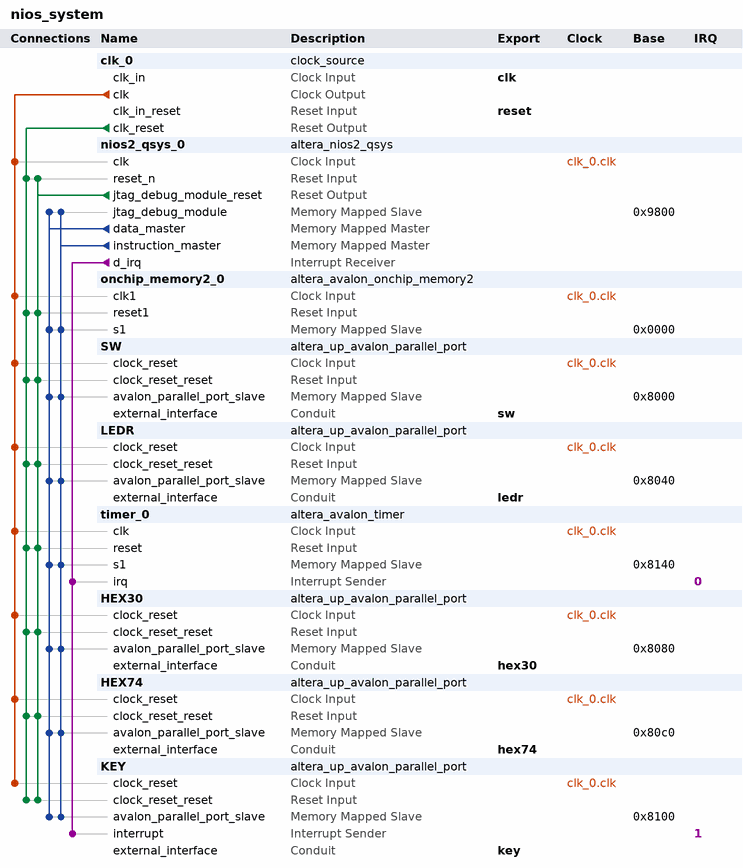
[diagram p0: system contents]
# Platform Designer (Qsys) system nios_system, Cyclone II EP2C35F672C6
# Parameters at their usual value, and those the tool derives, are not listed.
package require -exact qsys 13.0
create_system nios_system
set_project_property DEVICE_FAMILY {Cyclone II}
set_project_property DEVICE EP2C35F672C6

add_instance clk_0 clock_source 13.0
set_instance_parameter_value clk_0 clockFrequency 50000000

add_instance nios2_qsys_0 altera_nios2_qsys 13.0
set_instance_parameter_value nios2_qsys_0 resetSlave onchip_memory2_0.s1
set_instance_parameter_value nios2_qsys_0 mmu_TLBMissExcSlave None
set_instance_parameter_value nios2_qsys_0 exceptionSlave onchip_memory2_0.s1
set_instance_parameter_value nios2_qsys_0 breakSlave nios2_qsys_0.jtag_debug_module
set_instance_parameter_value nios2_qsys_0 impl Small
set_instance_parameter_value nios2_qsys_0 icache_size 4096

add_instance onchip_memory2_0 altera_avalon_onchip_memory2 13.0.1.99.2
set_instance_parameter_value onchip_memory2_0 dataWidth 32
set_instance_parameter_value onchip_memory2_0 dualPort false
set_instance_parameter_value onchip_memory2_0 initMemContent true
set_instance_parameter_value onchip_memory2_0 initializationFileName onchip_mem.hex
set_instance_parameter_value onchip_memory2_0 memorySize 32768

add_instance SW altera_up_avalon_parallel_port 13.0
set_instance_parameter_value SW board DE2
set_instance_parameter_value SW preset {Slider Switches}
set_instance_parameter_value SW capture false
set_instance_parameter_value SW edge Rising
set_instance_parameter_value SW irq false

add_instance LEDR altera_up_avalon_parallel_port 13.0
set_instance_parameter_value LEDR board DE2
set_instance_parameter_value LEDR preset LEDs
set_instance_parameter_value LEDR leds Red
set_instance_parameter_value LEDR capture false
set_instance_parameter_value LEDR edge Rising
set_instance_parameter_value LEDR irq false

add_instance timer_0 altera_avalon_timer 13.0.1.99.2
set_instance_parameter_value timer_0 period 1
set_instance_parameter_value timer_0 periodUnits MSEC

add_instance HEX30 altera_up_avalon_parallel_port 13.0
set_instance_parameter_value HEX30 board DE2
set_instance_parameter_value HEX30 preset {Seven Segment Displays}
set_instance_parameter_value HEX30 capture false
set_instance_parameter_value HEX30 edge Rising
set_instance_parameter_value HEX30 irq false

add_instance HEX74 altera_up_avalon_parallel_port 13.0
set_instance_parameter_value HEX74 board DE2
set_instance_parameter_value HEX74 preset {Seven Segment Displays}
set_instance_parameter_value HEX74 sevensegs {7 to 4}
set_instance_parameter_value HEX74 capture false
set_instance_parameter_value HEX74 edge Rising
set_instance_parameter_value HEX74 irq false

add_instance KEY altera_up_avalon_parallel_port 13.0
set_instance_parameter_value KEY board DE2
set_instance_parameter_value KEY preset Pushbuttons
set_instance_parameter_value KEY capture true
set_instance_parameter_value KEY edge Rising
set_instance_parameter_value KEY irq true

# connections
add_connection clk_0.clk HEX30.clock_reset clock
add_connection clk_0.clk HEX74.clock_reset clock
add_connection clk_0.clk KEY.clock_reset clock
add_connection clk_0.clk LEDR.clock_reset clock
add_connection clk_0.clk nios2_qsys_0.clk clock
add_connection clk_0.clk onchip_memory2_0.clk1 clock
add_connection clk_0.clk SW.clock_reset clock
add_connection clk_0.clk timer_0.clk clock
add_connection clk_0.clk_reset HEX30.clock_reset_reset reset
add_connection clk_0.clk_reset HEX74.clock_reset_reset reset
add_connection clk_0.clk_reset KEY.clock_reset_reset reset
add_connection clk_0.clk_reset LEDR.clock_reset_reset reset
add_connection clk_0.clk_reset nios2_qsys_0.reset_n reset
add_connection clk_0.clk_reset onchip_memory2_0.reset1 reset
add_connection clk_0.clk_reset SW.clock_reset_reset reset
add_connection clk_0.clk_reset timer_0.reset reset
add_connection nios2_qsys_0.jtag_debug_module_reset HEX30.clock_reset_reset reset
add_connection nios2_qsys_0.jtag_debug_module_reset HEX74.clock_reset_reset reset
add_connection nios2_qsys_0.jtag_debug_module_reset KEY.clock_reset_reset reset
add_connection nios2_qsys_0.jtag_debug_module_reset LEDR.clock_reset_reset reset
add_connection nios2_qsys_0.jtag_debug_module_reset nios2_qsys_0.reset_n reset
add_connection nios2_qsys_0.jtag_debug_module_reset onchip_memory2_0.reset1 reset
add_connection nios2_qsys_0.jtag_debug_module_reset SW.clock_reset_reset reset
add_connection nios2_qsys_0.jtag_debug_module_reset timer_0.reset reset
add_connection nios2_qsys_0.data_master HEX30.avalon_parallel_port_slave avalon
set_connection_parameter_value nios2_qsys_0.data_master/HEX30.avalon_parallel_port_slave baseAddress 0x8080
add_connection nios2_qsys_0.data_master HEX74.avalon_parallel_port_slave avalon
set_connection_parameter_value nios2_qsys_0.data_master/HEX74.avalon_parallel_port_slave baseAddress 0x80c0
add_connection nios2_qsys_0.data_master KEY.avalon_parallel_port_slave avalon
set_connection_parameter_value nios2_qsys_0.data_master/KEY.avalon_parallel_port_slave baseAddress 0x8100
add_connection nios2_qsys_0.data_master LEDR.avalon_parallel_port_slave avalon
set_connection_parameter_value nios2_qsys_0.data_master/LEDR.avalon_parallel_port_slave baseAddress 0x8040
add_connection nios2_qsys_0.data_master nios2_qsys_0.jtag_debug_module avalon
set_connection_parameter_value nios2_qsys_0.data_master/nios2_qsys_0.jtag_debug_module baseAddress 0x9800
add_connection nios2_qsys_0.data_master onchip_memory2_0.s1 avalon
set_connection_parameter_value nios2_qsys_0.data_master/onchip_memory2_0.s1 baseAddress 0x0000
add_connection nios2_qsys_0.data_master SW.avalon_parallel_port_slave avalon
set_connection_parameter_value nios2_qsys_0.data_master/SW.avalon_parallel_port_slave baseAddress 0x8000
add_connection nios2_qsys_0.data_master timer_0.s1 avalon
set_connection_parameter_value nios2_qsys_0.data_master/timer_0.s1 baseAddress 0x8140
add_connection nios2_qsys_0.instruction_master HEX30.avalon_parallel_port_slave avalon
set_connection_parameter_value nios2_qsys_0.instruction_master/HEX30.avalon_parallel_port_slave baseAddress 0x8080
add_connection nios2_qsys_0.instruction_master HEX74.avalon_parallel_port_slave avalon
set_connection_parameter_value nios2_qsys_0.instruction_master/HEX74.avalon_parallel_port_slave baseAddress 0x80c0
add_connection nios2_qsys_0.instruction_master KEY.avalon_parallel_port_slave avalon
set_connection_parameter_value nios2_qsys_0.instruction_master/KEY.avalon_parallel_port_slave baseAddress 0x8100
add_connection nios2_qsys_0.instruction_master LEDR.avalon_parallel_port_slave avalon
set_connection_parameter_value nios2_qsys_0.instruction_master/LEDR.avalon_parallel_port_slave baseAddress 0x8040
add_connection nios2_qsys_0.instruction_master nios2_qsys_0.jtag_debug_module avalon
set_connection_parameter_value nios2_qsys_0.instruction_master/nios2_qsys_0.jtag_debug_module baseAddress 0x9800
add_connection nios2_qsys_0.instruction_master onchip_memory2_0.s1 avalon
set_connection_parameter_value nios2_qsys_0.instruction_master/onchip_memory2_0.s1 baseAddress 0x0000
add_connection nios2_qsys_0.instruction_master SW.avalon_parallel_port_slave avalon
set_connection_parameter_value nios2_qsys_0.instruction_master/SW.avalon_parallel_port_slave baseAddress 0x8000
add_connection nios2_qsys_0.instruction_master timer_0.s1 avalon
set_connection_parameter_value nios2_qsys_0.instruction_master/timer_0.s1 baseAddress 0x8140
add_connection nios2_qsys_0.d_irq KEY.interrupt interrupt
set_connection_parameter_value nios2_qsys_0.d_irq/KEY.interrupt irqNumber 1
add_connection nios2_qsys_0.d_irq timer_0.irq interrupt
set_connection_parameter_value nios2_qsys_0.d_irq/timer_0.irq irqNumber 0

# exported interfaces
add_interface clk clock sink
set_interface_property clk EXPORT_OF clk_0.clk_in
add_interface reset reset sink
set_interface_property reset EXPORT_OF clk_0.clk_in_reset
add_interface sw conduit end
set_interface_property sw EXPORT_OF SW.external_interface
add_interface ledr conduit end
set_interface_property ledr EXPORT_OF LEDR.external_interface
add_interface hex30 conduit end
set_interface_property hex30 EXPORT_OF HEX30.external_interface
add_interface hex74 conduit end
set_interface_property hex74 EXPORT_OF HEX74.external_interface
add_interface key conduit end
set_interface_property key EXPORT_OF KEY.external_interface

set_interconnect_requirement {$system} qsys_mm.clockCrossingAdapter HANDSHAKE
set_interconnect_requirement {$system} qsys_mm.maxAdditionalLatency 1

save_system nios_system.qsys
